# EAGLE schematic 140006R_3HP_Upgrade (EAGLE 6.5.0)

## Sheet 1 of 4
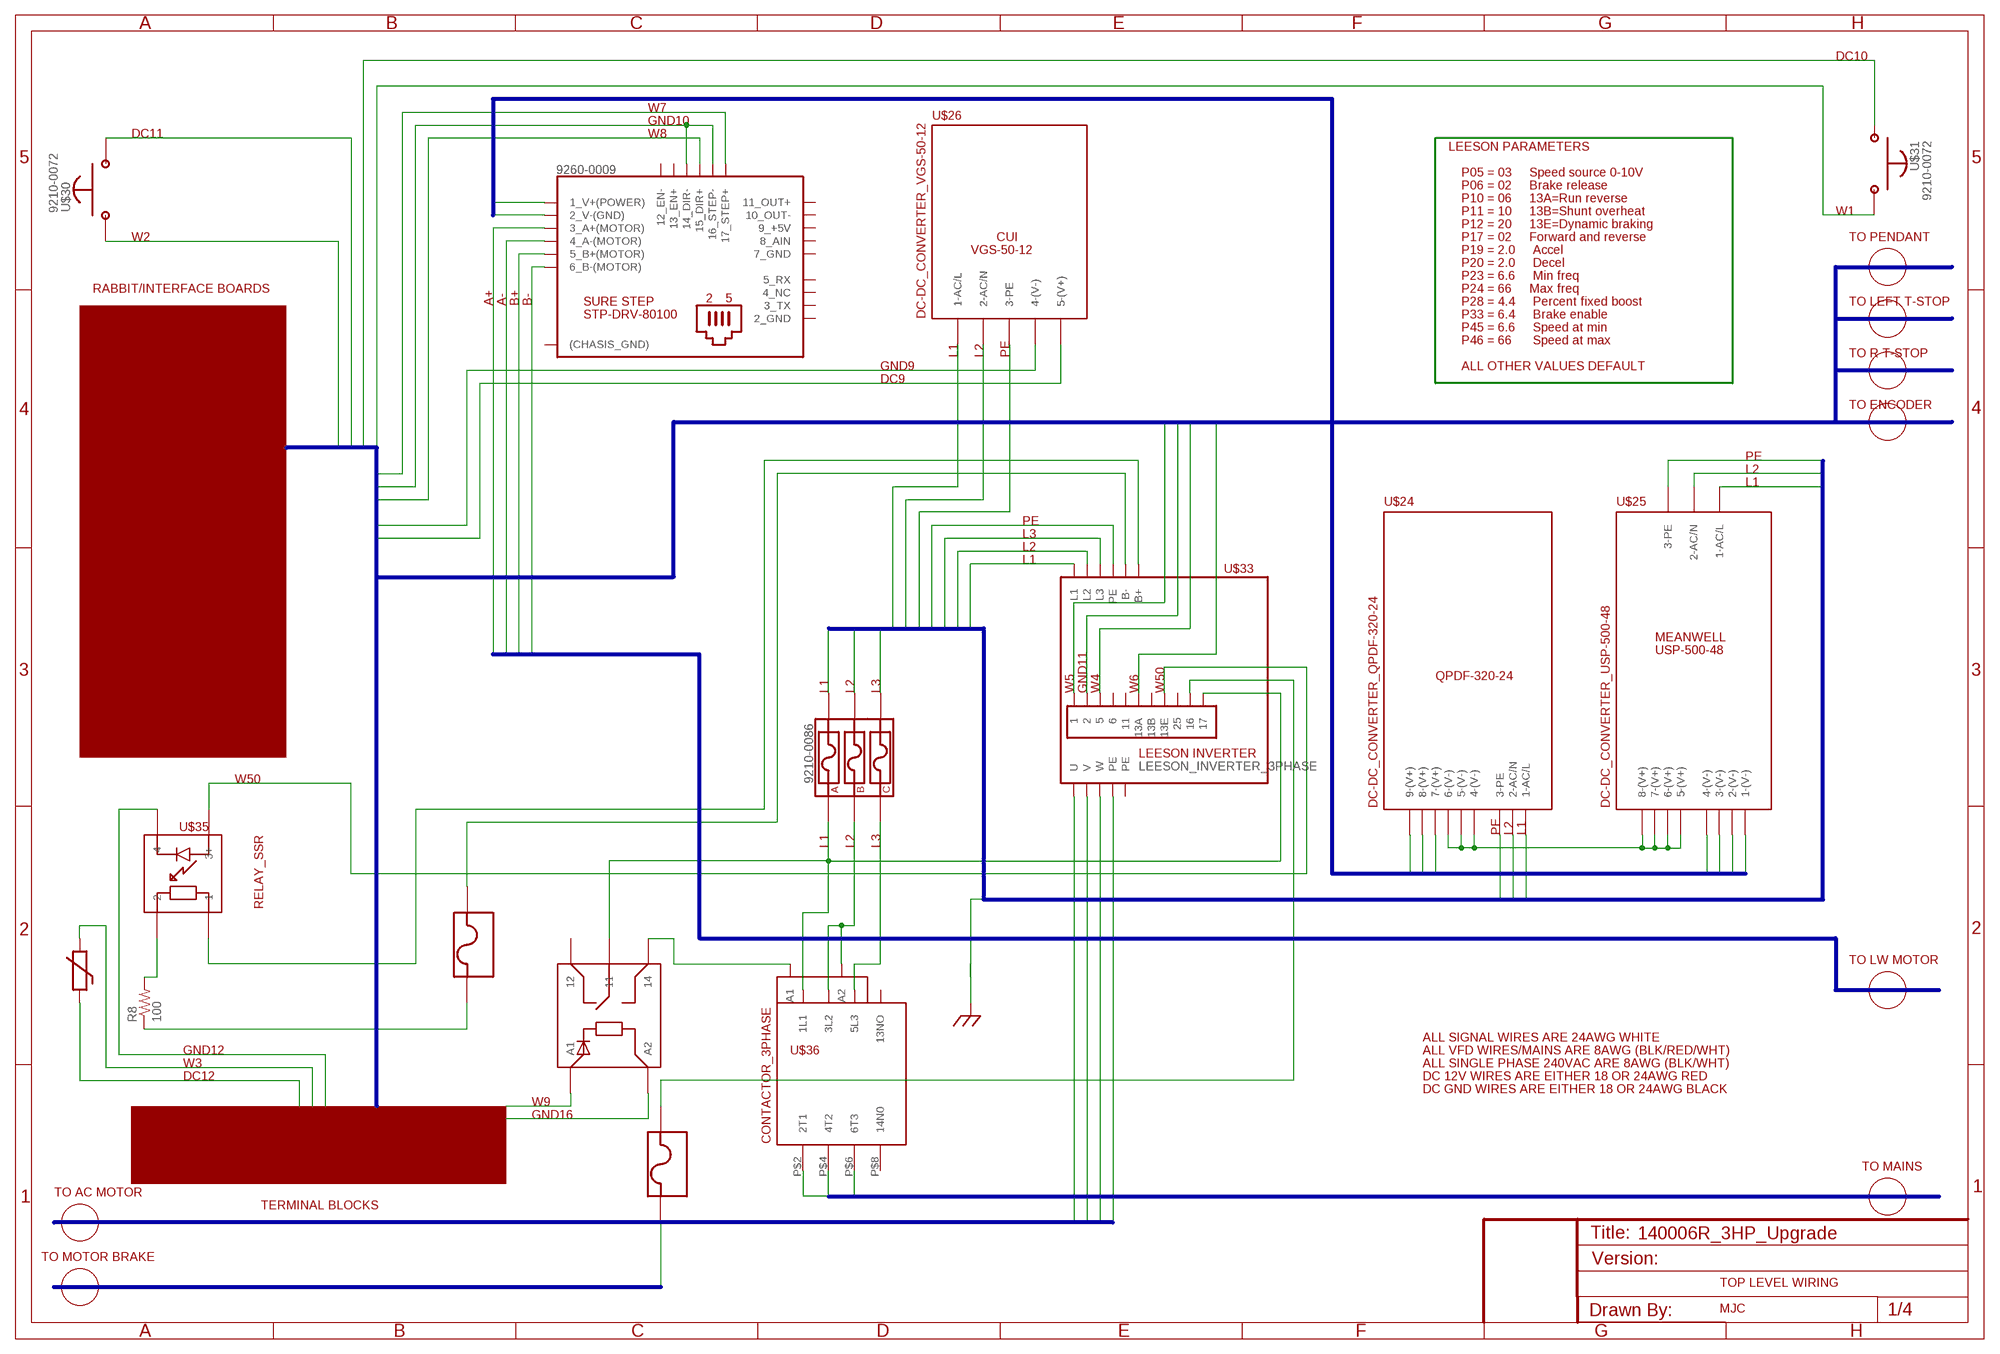
[diagram p0: schematic, sheet 1]

### Parts
PE2  GND_CHASSIS  [BOGUS]
R8  100  R-US_V234/12  [V234/12]
U$24  DC-DC_CONVERTER_QPDF-320-24  [BOGUS]
U$25  DC-DC_CONVERTER_USP-500-48  [BOGUS]
U$26  DC-DC_CONVERTER_VGS-50-12  [BOGUS]
U$27  THERMISTOR  [BOGUS]
U$28  TERMINAL_BLOCK_FUSED  [BOGUS]
U$29  TERMINAL_BLOCK_FUSED  [BOGUS]
U$30  SWITCH_MOM_NO  [BOGUS]
U$31  SWITCH_MOM_NO  [BOGUS]
U$32  SURE_STEP_STP-DRV-80100  [BOGUS]
U$33  LEESON_INVERTER_3PHASE  [BOGUS]
U$34  FUSE_HOLDER_3-POLE  [BOGUS]
U$35  RELAY_SSR  [BOGUS]
U$36  CONTACTOR_3PHASE  [BOGUS]
U$37  RELAY_TB  [BOGUS]

### Nets
B$1: PE2.P$1(PE) U$36.P$2(2T1) U$36.P$4(4T2) U$36.P$6(6T3)
B$8: U$33.P$18(PE) U$33.P$20(U) U$33.P$21(V) U$33.P$22(W)
B$9: U$24.P$1(1-AC/L) U$24.P$2(2-AC/N) U$24.P$3(3-PE) U$25.P$2(1-AC/L) U$25.P$4(2-AC/N) U$25.P$6(3-PE) U$26.P$1(1-AC/L) U$26.P$2(2-AC/N) U$26.P$3(3-PE) U$33.P$10 U$33.P$14(L1) U$33.P$15(L2) U$33.P$16(L3) U$33.P$17(PE) U$34.P$2 U$34.P$3 U$34.P$4 U$34.P$6 U$36.P$1(1L1) U$37.P$1
B$10: U$24.P$7(7-(V+)) U$24.P$8(8-(V+)) U$24.P$9(9-(V+)) U$25.P$1(1-(V-)) U$25.P$3(2-(V-)) U$25.P$5(3-(V-)) U$25.P$7(4-(V-)) U$32.P$2(1_V+(POWER)) U$32.P$3(2_V-(GND))
B$11: U$26.P$4(4-(V-)) U$26.P$5(5-(V+)) U$30.P$1 U$30.P$2 U$31.P$2 U$32.P$15(14_DIR-) U$32.P$16(15_DIR+) U$32.P$17(16_STEP-) U$32.P$18(17_STEP+) U$33.P$1 U$33.P$2 U$33.P$3 U$33.P$6(13A)
B$12: U$28.P$1
B$13: U$32.P$4(3_A+(MOTOR)) U$32.P$5(4_A-(MOTOR)) U$32.P$6(5_B+(MOTOR)) U$32.P$7(6_B-(MOTOR))
N$12: U$24.P$4(4-(V-)) U$24.P$5(5-(V-)) U$24.P$6(6-(V-)) U$25.P$8(5-(V+)) U$25.P$9(6-(V+)) U$25.P$10(7-(V+)) U$25.P$11(8-(V+))
N$13: U$29.P$2 U$33.P$13(B-)
N$14: U$33.P$12(B+) U$35.P$1
N$15: R8.2 U$35.P$2
N$16: R8.1 U$29.P$1
N$17: U$28.P$2 U$33.P$9
N$18: U$33.P$8(13E) U$35.P$3(3+)
N$19: U$35.P$4
N$20: U$27.P$1
N$21: U$27.P$2
N$25: U$34.P$5 U$36.P$5(5L3)
N$26: U$34.P$1 U$36.P$3(3L2) U$36.P$10(A2)
N$28: U$37.P$5(A2)
N$29: U$37.P$4(A1)
N$30: U$36.P$9(A1) U$37.P$3
Unconnected: U$31.P$1 U$33.P$4 U$33.P$5 U$33.P$7(13B) U$33.P$11 U$36.P$7(13NO) U$36.P$8(14N0) U$37.P$2

### Buses
B$1
B$2
B$3
B$4
B$5
B$6
B$7

### Notes on the sheet
- DC10
- W7
- GND10
- DC11 | W8
- LEESON PARAMETERS
- P05 = 03     Speed source 0-10V
- P06 = 02     Brake release
- P10 = 06     13A=Run reverse
- P11 = 10     13B=Shunt overheat | W1
- P12 = 20     13E=Dynamic braking
- W2 | P17 = 02     Forward and reverse | TO PENDANT
- P19 = 2.0     Accel
- P20 = 2.0     Decel
- P23 = 6.6     Min freq
- RABBIT/INTERFACE BOARDS | P24 = 66     Max freq
- A+ | A- | B+ | B- | P28 = 4.4     Percent fixed boost | TO LEFT T-STOP
- P33 = 6.4     Brake enable
- P45 = 6.6     Speed at min
- P46 = 66      Speed at max
- L1 | L2 | PE | TO R T-STOP
- GND9 | ALL OTHER VALUES DEFAULT
- DC9
- TO ENCODER
- PE
- L2
- L1
- PE
- L3
- L2
- L1
- L1 | L2 | L3 | W5 | GND11 | W4 | W6 | W50
- W50
- PE | L2 | L1
- L1 | L2 | L3
- TO LW MOTOR
- ALL SIGNAL WIRES ARE 24AWG WHITE
- GND12 | ALL VFD WIRES/MAINS ARE 8AWG (BLK/RED/WHT)
- W3 | ALL SINGLE PHASE 240VAC ARE 8AWG (BLK/WHT)
- DC12 | DC 12V WIRES ARE EITHER 18 OR 24AWG RED
- DC GND WIRES ARE EITHER 18 OR 24AWG BLACK
- W9
- GND16
- TO MAINS
- TO AC MOTOR
- TERMINAL BLOCKS
- TO MOTOR BRAKE
- TOP LEVEL WIRING
- MJC

## Sheet 2 of 4
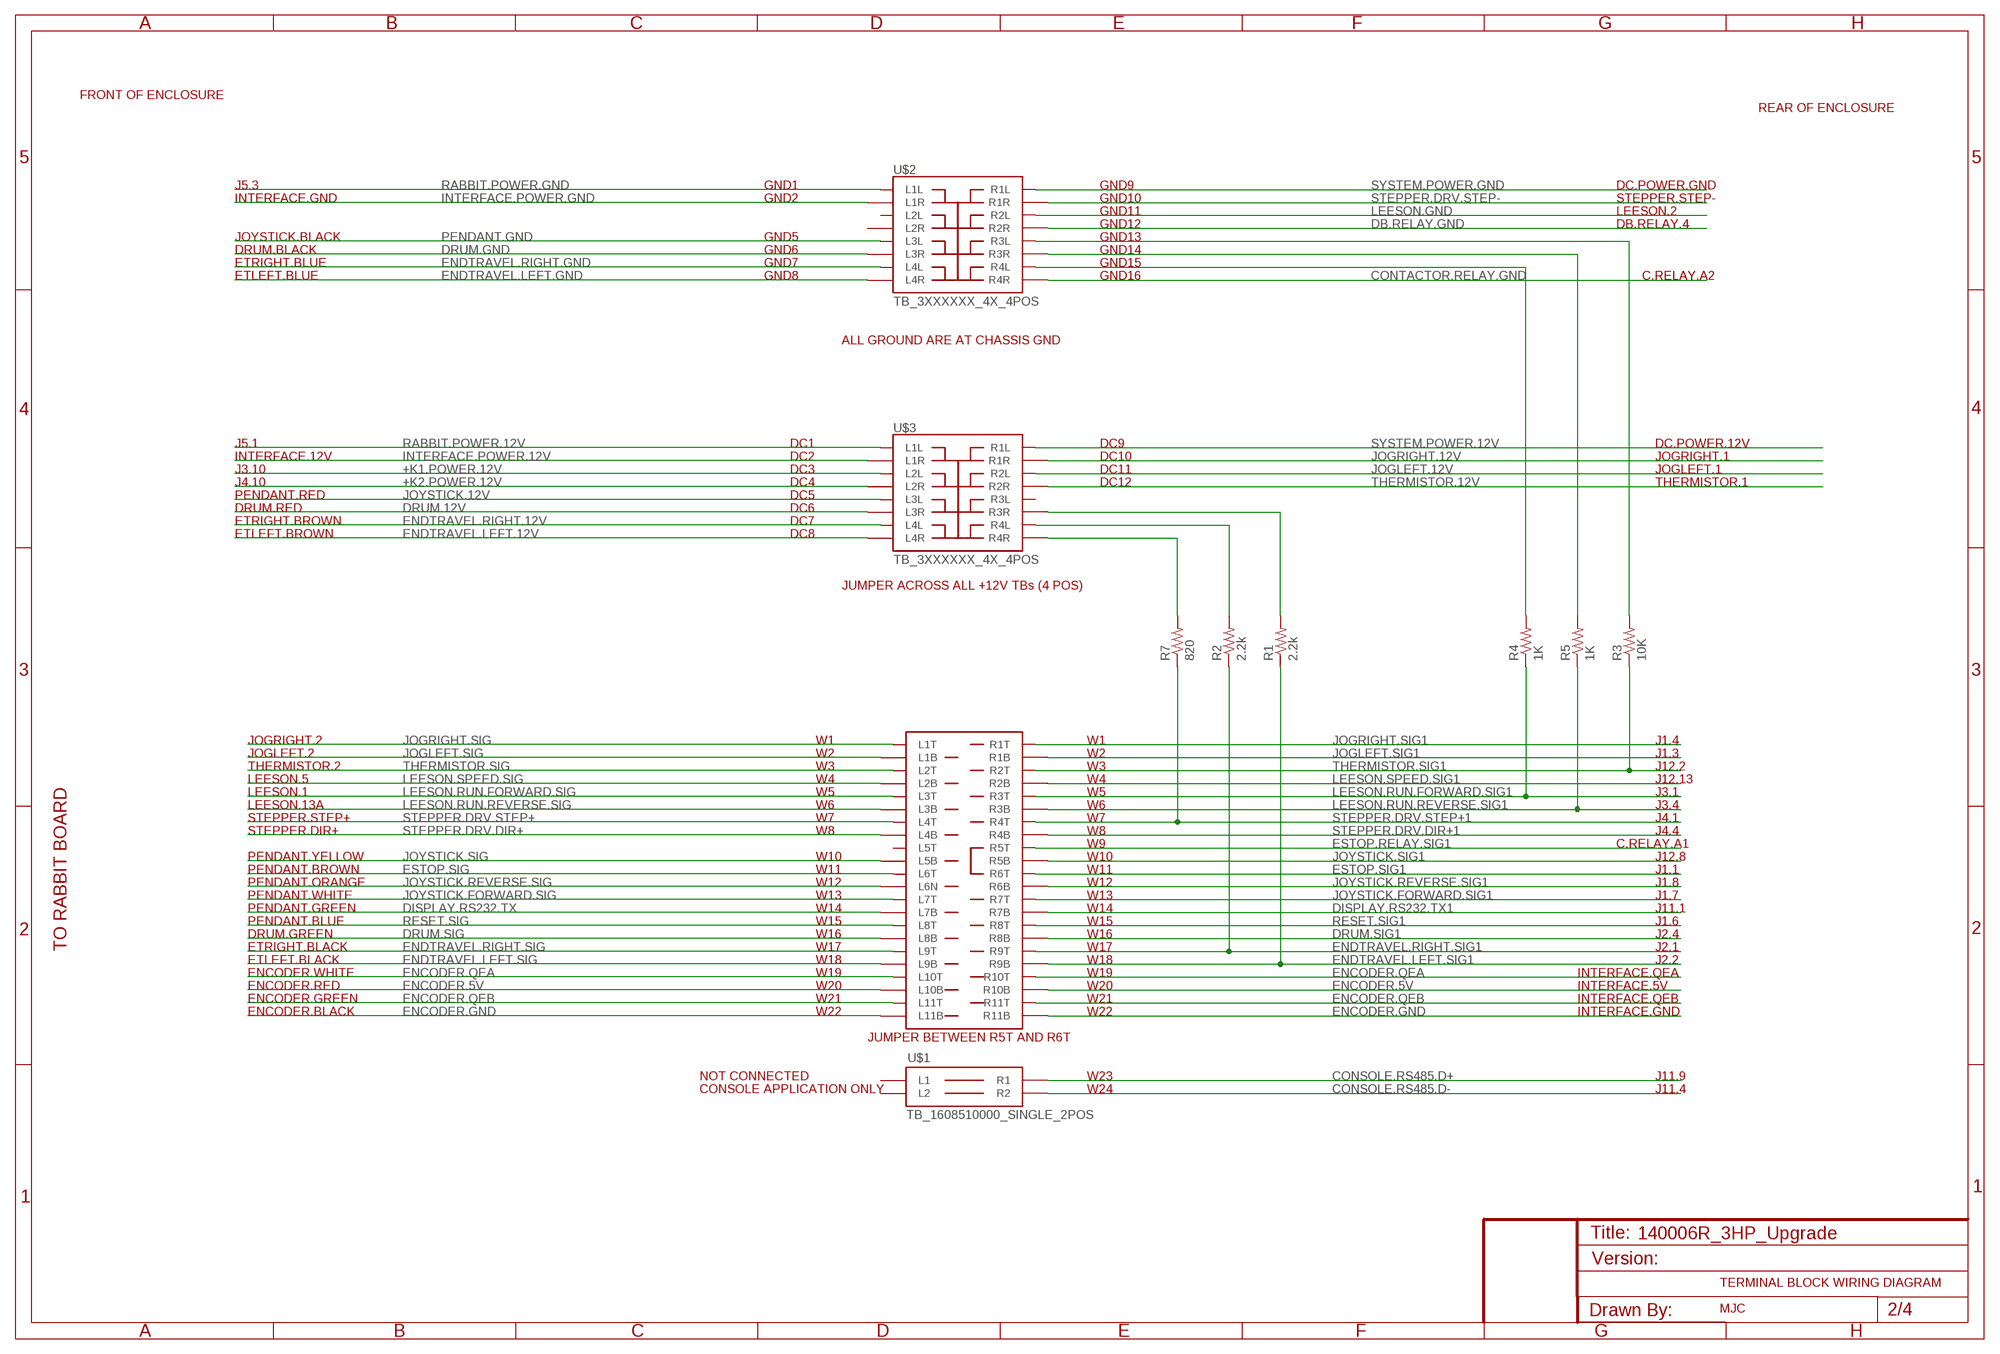
[diagram p1: schematic, sheet 2]

### Parts
R1  2.2k  R-US_V234/12  [V234/12]
R2  2.2k  R-US_V234/12  [V234/12]
R3  10K  R-US_V234/12  [V234/12]
R4  1K  R-US_V234/12  [V234/12]
R5  1K  R-US_V234/12  [V234/12]
R7  820  R-US_V234/12  [V234/12]
U$1  TB_1608510000_SINGLE_2POS  [BOGUS]
U$2  TB_3XXXXXX_4X_4POS  [BOGUS]
U$3  TB_3XXXXXX_4X_4POS  [BOGUS]
U$4  TB_3031160_11POS_DUAL_2  [BOGUS]

### Nets
+K1.POWER.12V: U$3.P$3(L2L) ; also sheet 4
+K2.POWER.12V: U$3.P$4(L2R) ; also sheet 4
CONSOLE.RS485.D+: U$1.P$3(R1) ; also sheet 4
CONSOLE.RS485.D-: U$1.P$4(R2) ; also sheet 4
CONTACTOR.RELAY.GND: U$2.P$16(R4R)
DB.RELAY.GND: U$2.P$12(R2R)
DISPLAY.RS232.TX: U$4.P$13(L7B) ; also sheet 4
DRUM.12V: U$3.P$6(L3R)
DRUM.GND: U$2.P$6(L3R)
DRUM.SIG: U$4.P$15(L8B)
ENCODER.5V: U$4.P$19(L10B) U$4.P$41(R10B) ; also sheet 4
ENCODER.GND: U$4.P$21(L11B) U$4.P$43(R11B) ; also sheet 4
ENCODER.QEA: U$4.P$20(L10T) U$4.P$42(R10T)
ENCODER.QEB: U$4.P$22(L11T) U$4.P$44(R11T)
ENDTRAVEL.LEFT.12V: U$3.P$8(L4R)
ENDTRAVEL.LEFT.GND: U$2.P$8(L4R)
ENDTRAVEL.LEFT.SIG: U$4.P$17(L9B) ; also sheet 4
ENDTRAVEL.LEFT.SIG1: R1.1
ENDTRAVEL.RIGHT.12V: U$3.P$7(L4L)
ENDTRAVEL.RIGHT.GND: U$2.P$7(L4L)
ENDTRAVEL.RIGHT.SIG: U$4.P$18(L9T) ; also sheet 4
ENDTRAVEL.RIGHT.SIG1: R2.1
ESTOP.SIG: U$4.P$12(L6T) ; also sheet 4
INTERFACE.POWER.12V: U$3.P$2(L1R) ; also sheet 4
INTERFACE.POWER.GND: U$2.P$2(L1R) ; also sheet 4
JOG.RIGHT.12V: R7.2 U$3.P$16(R4R)
JOGLEFT.SIG: U$4.P$1(L1B) ; also sheet 4
JOGRIGHT.SIG: U$4.P$2(L1T) ; also sheet 4
JOYSTICK.12V: U$3.P$5(L3L)
JOYSTICK.FORWARD.SIG: U$4.P$14(L7T) ; also sheet 4
JOYSTICK.REVERSE.SIG: U$4.P$11(L6N) ; also sheet 4
JOYSTICK.SIG: U$4.P$9(L5B) ; also sheet 4
LEESON.GND: U$2.P$11(R2L)
LEESON.RUN.FORWARD.SIG: U$4.P$6(L3T)
LEESON.RUN.FORWARD.SIG1: R4.1
LEESON.RUN.REVERSE.SIG: U$4.P$5(L3B) ; also sheet 4
LEESON.RUN.REVERSE.SIG1: R5.1
LEESON.SPEED.SIG: U$4.P$3(L2B) ; also sheet 4
N$6: R2.2 U$3.P$15(R4L)
N$7: R1.2 U$3.P$14(R3R)
N$8: R4.2 U$2.P$15(R4L)
N$9: R5.2 U$2.P$14(R3R)
N$10: R3.2 U$2.P$13(R3L)
PENDANT.GND: U$2.P$5(L3L)
RABBIT.POWER.12V: U$3.P$1(L1L) ; also sheet 4
RABBIT.POWER.GND: U$2.P$1(L1L) ; also sheet 4
RESET.SIG: U$4.P$16(L8T) ; also sheet 4
STEPPER.DRV.DIR+: U$4.P$7(L4B) ; also sheet 4
STEPPER.DRV.STEP+: U$4.P$8(L4T) ; also sheet 4
STEPPER.DRV.STEP+1: R7.1
STEPPER.DRV.STEP-: U$2.P$10(R1R)
SYSTEM.POWER.GND: U$2.P$9(R1L)
THERMISTOR.12V: U$3.P$12(R2R)
THERMISTOR.SIG: U$4.P$4(L2T) ; also sheet 4
THERMISTOR.SIG1: R3.1
Unconnected: U$1.P$1(L1) U$1.P$2(L2) U$2.P$3(L2L) U$2.P$4(L2R) U$3.P$9(R1L) U$3.P$10(R1R) U$3.P$11(R2L) U$3.P$13(R3L) U$4.P$10(L5T) U$4.P$23(R1B) U$4.P$24(R1T) U$4.P$25(R2B) U$4.P$26(R2T) U$4.P$27(R3B) U$4.P$28(R3T) U$4.P$29(R4B) U$4.P$30(R4T) U$4.P$31(R5B) U$4.P$32(R5T) U$4.P$33(R6B) U$4.P$34(R6T) U$4.P$35(R7B) U$4.P$36(R7T) U$4.P$37(R8B) U$4.P$38(R8T) U$4.P$39(R9B) U$4.P$40(R9T)

### Notes on the sheet
- FRONT OF ENCLOSURE
- REAR OF ENCLOSURE
- J5.3 | GND1 | GND9 | DC.POWER.GND
- INTERFACE.GND | GND2 | GND10 | STEPPER.STEP-
- GND11 | LEESON.2
- GND12 | DB.RELAY.4
- JOYSTICK.BLACK | GND5 | GND13
- DRUM.BLACK | GND6 | GND14
- ETRIGHT.BLUE | GND7 | GND15
- ETLEFT.BLUE | GND8 | GND16 | C.RELAY.A2
- ALL GROUND ARE AT CHASSIS GND
- J5.1 | DC1 | DC9 | DC.POWER.12V
- INTERFACE.12V | DC2 | DC10 | JOGRIGHT.1
- J3.10 | DC3 | DC11 | JOGLEFT.1
- J4.10 | DC4 | DC12 | THERMISTOR.1
- PENDANT.RED | DC5
- DRUM.RED | DC6
- ETRIGHT.BROWN | DC7
- ETLEFT.BROWN | DC8
- JUMPER ACROSS ALL +12V TBs (4 POS)
- JOGRIGHT.2 | W1 | W1 | J1.4
- JOGLEFT.2 | W2 | W2 | J1.3
- THERMISTOR.2 | W3 | W3 | J12.2
- LEESON.5 | W4 | W4 | J12.13
- LEESON.1 | W5 | W5 | J3.1
- LEESON.13A | W6 | W6 | J3.4
- STEPPER.STEP+ | W7 | W7 | J4.1
- STEPPER.DIR+ | W8 | W8 | J4.4
- W9 | C.RELAY.A1
- PENDANT.YELLOW | W10 | W10 | J12.8
- PENDANT.BROWN | W11 | W11 | J1.1
- PENDANT.ORANGE | W12 | W12 | J1.8
- PENDANT.WHITE | W13 | W13 | J1.7
- PENDANT.GREEN | W14 | W14 | J11.1
- PENDANT.BLUE | W15 | W15 | J1.6
- DRUM.GREEN | W16 | W16 | J2.4
- TO RABBIT BOARD | ETRIGHT.BLACK | W17 | W17 | J2.1
- ETLEFT.BLACK | W18 | W18 | J2.2
- ENCODER.WHITE | W19 | W19 | INTERFACE.QEA
- ENCODER.RED | W20 | W20 | INTERFACE.5V
- ENCODER.GREEN | W21 | W21 | INTERFACE.QEB
- ENCODER.BLACK | W22 | W22 | INTERFACE.GND
- JUMPER BETWEEN R5T AND R6T
- NOT CONNECTED | W23 | J11.9
- CONSOLE APPLICATION ONLY | W24 | J11.4
- TERMINAL BLOCK WIRING DIAGRAM
- MJC

## Sheet 3 of 4
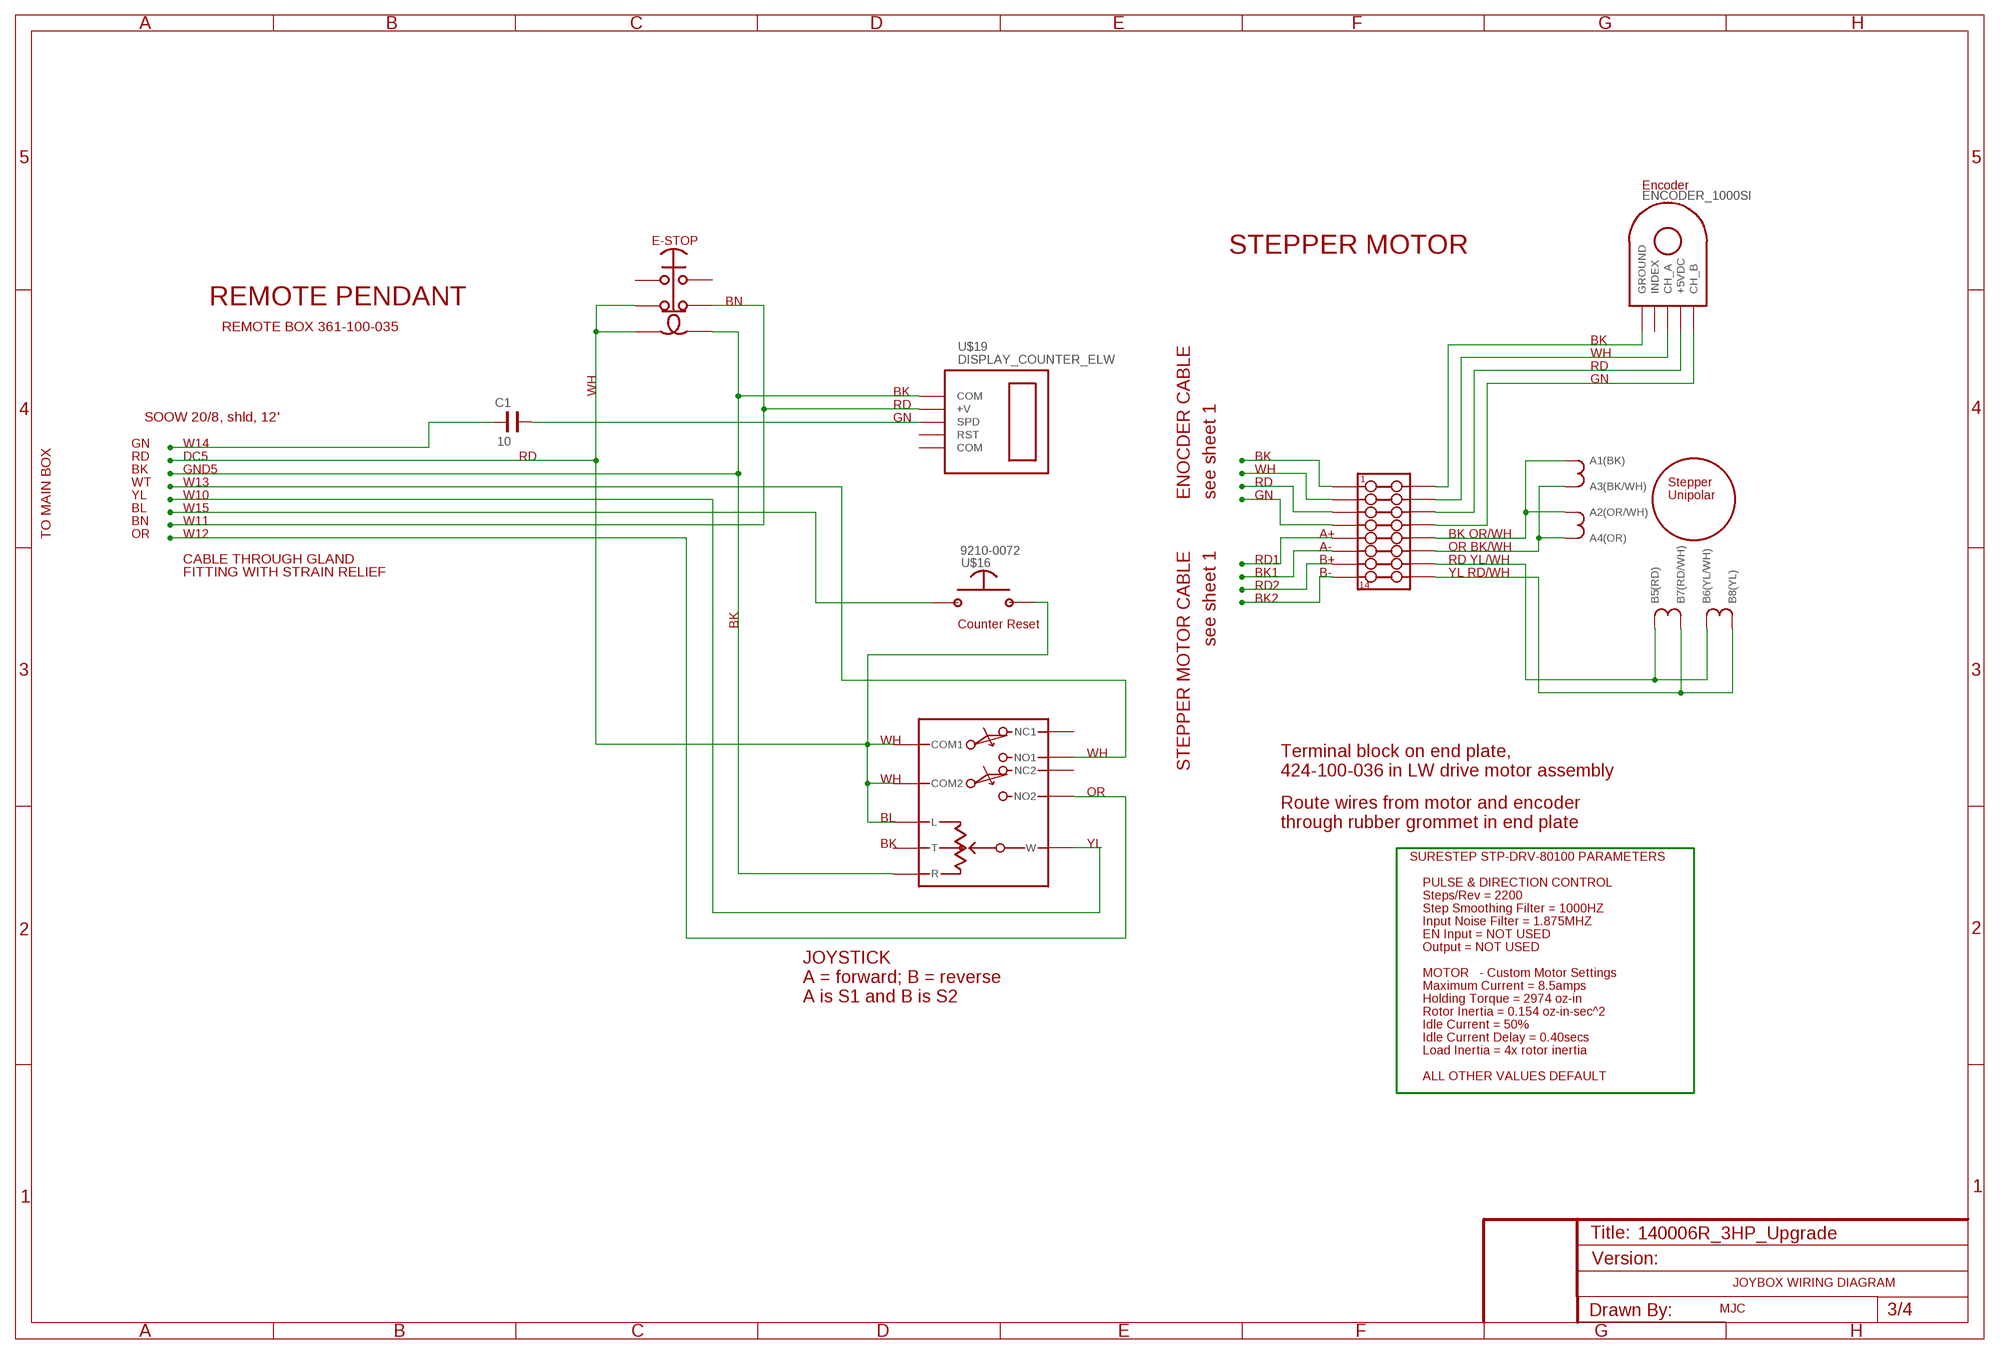
[diagram p2: schematic, sheet 3]

### Parts
C1  10  C0805  [R0805]
U$16  Counter Reset  SWITCH_MOM_NO  [BOGUS]
U$17  SWITCH_ESTOP_LIGHTED  [BOGUS]
U$18  JOYSTICK_PRO-5  [BOGUS]
U$19  DISPLAY_COUNTER_ELW  [BOGUS]
U$20  TERMINAL_BLOCK_8  [BOGUS]
U$21  MOTOR_STEPPER_UNIPOLAR  [BOGUS]
U$22  ENCODER_1000SI  [BOGUS]

### Nets
N$4: U$17.P$6 U$18.P$8(R) U$19.P$2(COM)
N$23: C1.2 U$19.P$5(SPD)
N$69: C1.1
N$72: U$18.P$6(NO1)
N$73: U$18.P$10(W)
N$75: U$17.P$4 U$19.P$1(+V)
N$76: U$18.P$7(NO2)
N$77: U$16.P$1
N$78: U$16.P$2 U$17.P$2 U$17.P$5 U$18.P$1(COM1) U$18.P$2(COM2) U$18.P$3(L)
N$81: U$20.P$12 U$21.P$1(A1(BK)) U$21.P$2(A2(OR/WH))
N$88: U$20.P$11 U$21.P$3(A3(BK/WH)) U$21.P$4(A4(OR))
N$89: U$20.P$9 U$21.P$7(B7(RD/WH)) U$21.P$8(B8(YL))
N$91: U$20.P$10 U$21.P$5(B5(RD)) U$21.P$6(B6(YL/WH))
N$92: U$20.P$16 U$22.P$4(GROUND)
N$93: U$20.P$15 U$22.P$2(CH_A)
N$94: U$20.P$14 U$22.P$1(+5VDC)
N$95: U$20.P$13 U$22.P$3(CH_B)
N$96: U$20.P$1
N$97: U$20.P$2
N$98: U$20.P$3
N$99: U$20.P$4
N$100: U$20.P$8
N$101: U$20.P$7
N$102: U$20.P$6
N$103: U$20.P$5
Unconnected: U$17.P$1 U$17.P$3 U$18.P$4(NC1) U$18.P$5(NC2) U$18.P$9(T) U$19.P$3(COM) U$19.P$4(RST) U$22.P$5(INDEX)

### Notes on the sheet
- STEPPER MOTOR
- REMOTE PENDANT | BN
- REMOTE BOX 361-100-035
- BK
- WH
- RD
- GN
- WH | BK
- RD
- SOOW 20/8, shld, 12' | GN
- TO MAIN BOX | GN | W14
- RD | DC5 | RD | BK
- BK | GND5 | WH
- WT | W13 | RD
- YL | W10 | ENOCDER CABLE | see sheet 1 | GN
- BL | W15
- BN | W11
- OR | W12 | A+ | BK OR/WH
- STEPPER MOTOR CABLE | see sheet 1 | A- | OR BK/WH
- CABLE THROUGH GLAND | RD1 | B+ | RD YL/WH
- FITTING WITH STRAIN RELIEF | BK1 | B- | YL RD/WH
- RD2
- BK2
- BK | Counter Reset
- WH
- WH | Terminal block on end plate,
- 424-100-036 in LW drive motor assembly
- WH
- OR
- Route wires from motor and encoder
- BL
- through rubber grommet in end plate
- BK | YL
- SURESTEP STP-DRV-80100 PARAMETERS
- PULSE & DIRECTION CONTROL
- Steps/Rev = 2200
- Step Smoothing Filter = 1000HZ
- Input Noise Filter = 1.875MHZ
- EN Input = NOT USED
- Output = NOT USED
- JOYSTICK
- MOTOR   - Custom Motor Settings
- A = forward; B = reverse
- Maximum Current = 8.5amps
- A is S1 and B is S2 | Holding Torque = 2974 oz-in
- Rotor Inertia = 0.154 oz-in-sec^2
- Idle Current = 50%
- Idle Current Delay = 0.40secs
- Load Inertia = 4x rotor inertia
- ALL OTHER VALUES DEFAULT
- JOYBOX WIRING DIAGRAM
- MJC

## Sheet 4 of 4
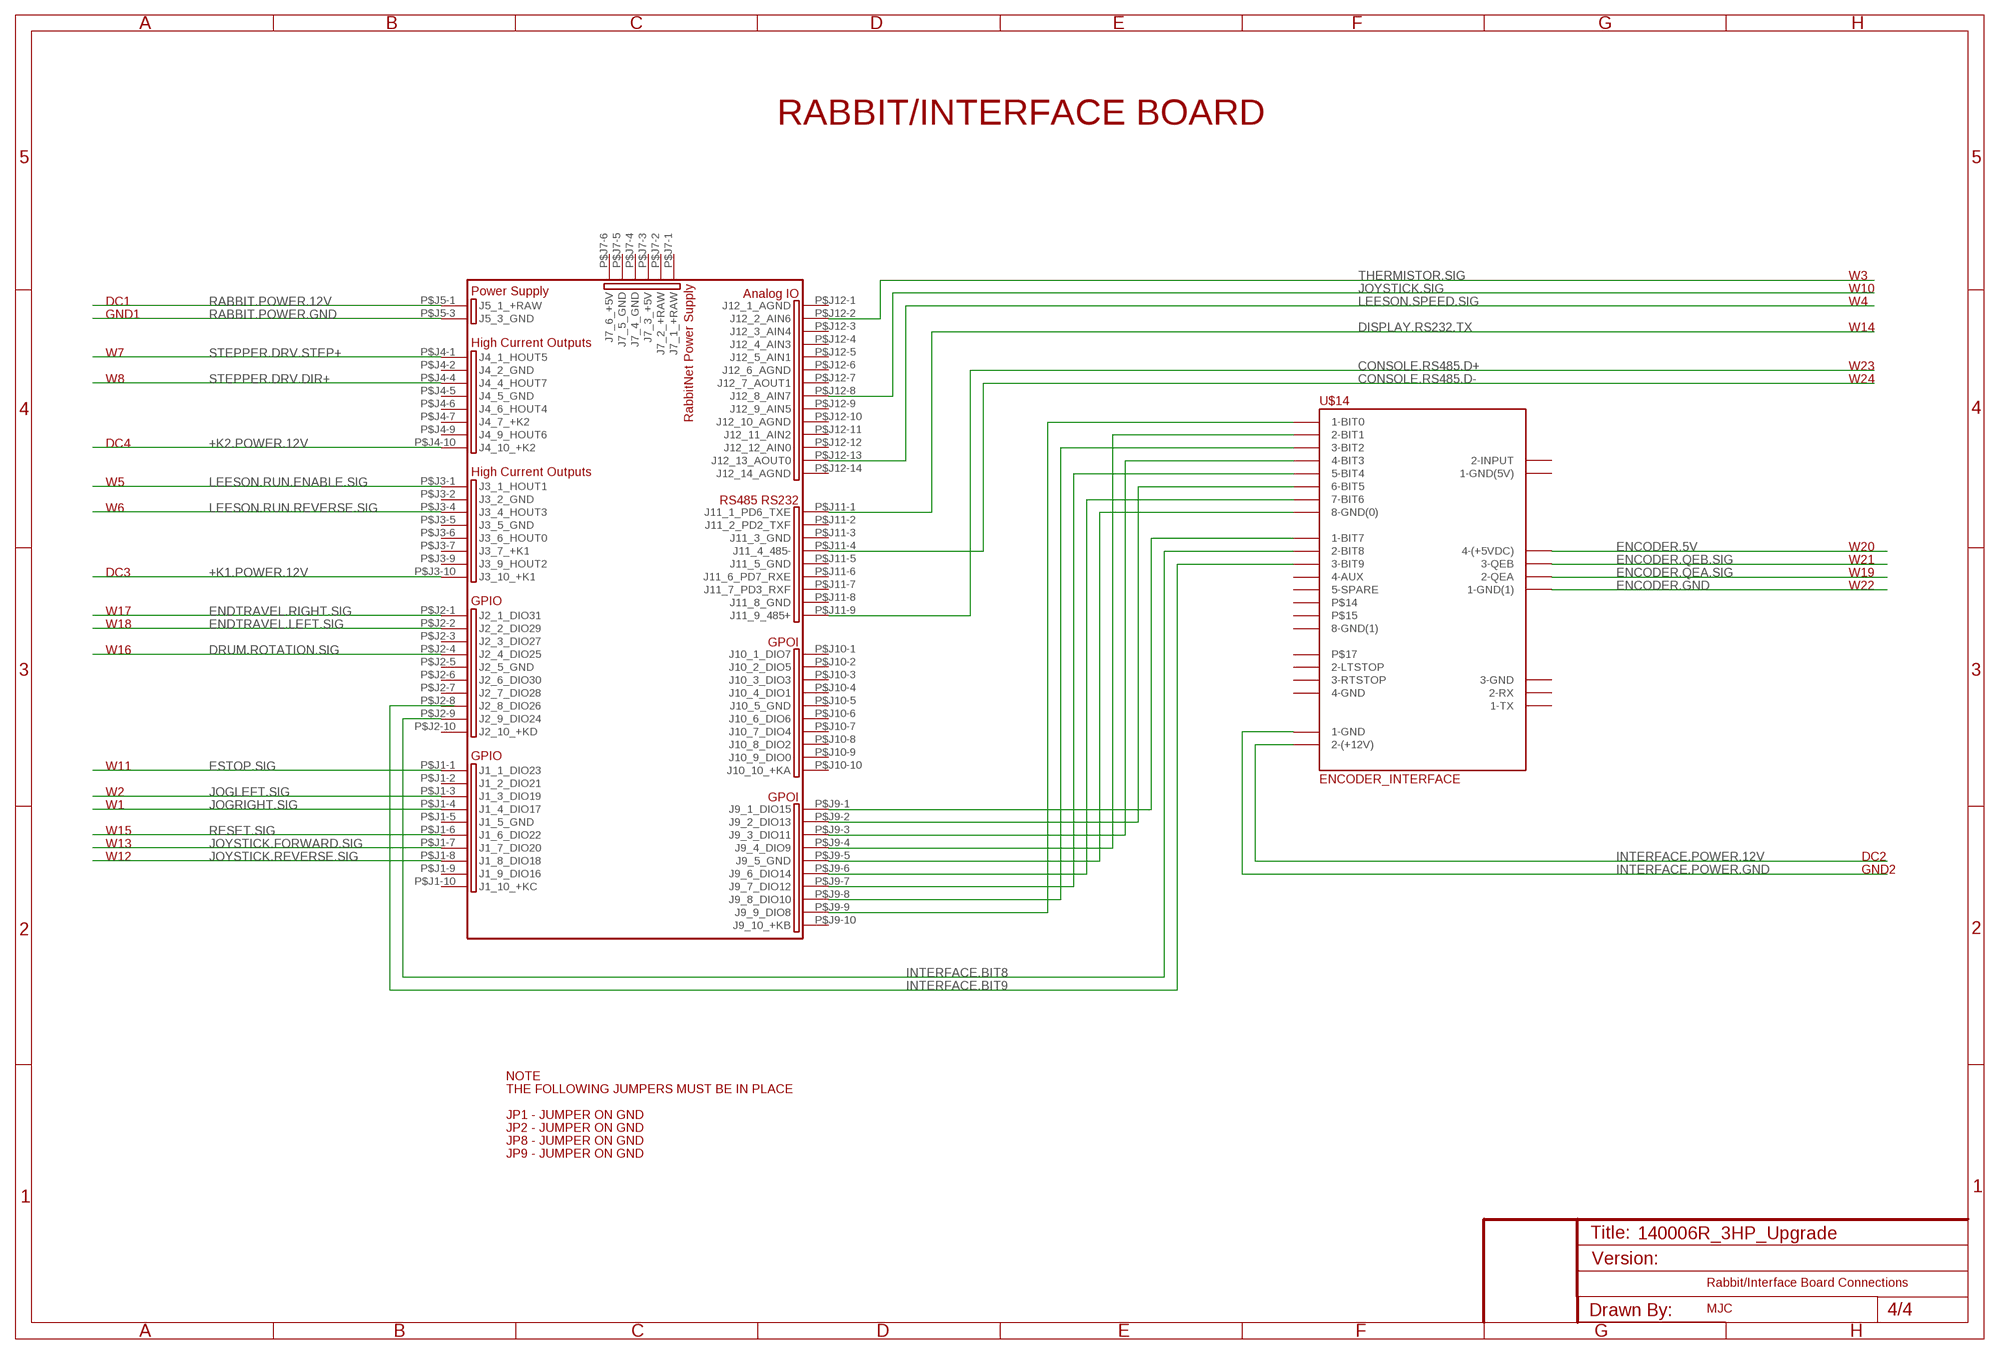
[diagram p3: schematic, sheet 4]

### Parts
U$14  ENCODER_INTERFACE  [BOGUS]
U$15  RABBIT_BL4S200(RCM4310)  [RABBIT_BL4S200]

### Nets
+K1.POWER.12V: U$15.P$J3-10(J3_10_+K1) ; also sheet 2
+K2.POWER.12V: U$15.P$J4-10(J4_10_+K2) ; also sheet 2
CONSOLE.RS485.D+: U$15.P$J11-9(J11_9_485+) ; also sheet 2
CONSOLE.RS485.D-: U$15.P$J11-4(J11_4_485-) ; also sheet 2
DISPLAY.RS232.TX: U$15.P$J11-1(J11_1_PD6_TXE) ; also sheet 2
DRUM.ROTATION.SIG: U$15.P$J2-4(J2_4_DIO25)
ENCODER.5V: U$14.P$19(4-(+5VDC)) ; also sheet 2
ENCODER.GND: U$14.P$4(1-GND(1)) ; also sheet 2
ENCODER.QEA.SIG: U$14.P$12(2-QEA)
ENCODER.QEB.SIG: U$14.P$17(3-QEB)
ENDTRAVEL.LEFT.SIG: U$15.P$J2-2(J2_2_DIO29) ; also sheet 2
ENDTRAVEL.RIGHT.SIG: U$15.P$J2-1(J2_1_DIO31) ; also sheet 2
ESTOP.SIG: U$15.P$J1-1(J1_1_DIO23) ; also sheet 2
INTERFACE.BIT7: U$14.P$2(1-BIT7) U$15.P$J9-1(J9_1_DIO15)
INTERFACE.BIT8: U$14.P$9(2-BIT8) U$15.P$J2-9(J2_9_DIO24)
INTERFACE.BIT9: U$14.P$15(3-BIT9)
INTERFACE.GND: U$14.P$27(8-GND(0)) U$15.P$J9-5(J9_5_GND)
INTERFACE.POWER.12V: U$14.P$7(2-(+12V)) ; also sheet 2
INTERFACE.POWER.GND: U$14.P$3(1-GND) ; also sheet 2
JOGLEFT.SIG: U$15.P$J1-3(J1_3_DIO19) ; also sheet 2
JOGRIGHT.SIG: U$15.P$J1-4(J1_4_DIO17) ; also sheet 2
JOYSTICK.FORWARD.SIG: U$15.P$J1-7(J1_7_DIO20) ; also sheet 2
JOYSTICK.REVERSE.SIG: U$15.P$J1-8(J1_8_DIO18) ; also sheet 2
JOYSTICK.SIG: U$15.P$J12-8(J12_8_AIN7) ; also sheet 2
LEESON.RUN.ENABLE.SIG: U$15.P$J3-1(J3_1_HOUT1)
LEESON.RUN.REVERSE.SIG: U$15.P$J3-4(J3_4_HOUT3) ; also sheet 2
LEESON.SPEED.SIG: U$15.P$J12-13(J12_13_AOUT0) ; also sheet 2
N$1: U$14.P$21(4-BIT3) U$15.P$J9-3(J9_3_DIO11)
N$71: U$14.P$25(6-BIT5) U$15.P$J9-2(J9_2_DIO13)
N$79: U$14.P$8(2-BIT1) U$15.P$J9-4(J9_4_DIO9)
N$80: U$14.P$26(7-BIT6) U$15.P$J9-6(J9_6_DIO14)
N$85: U$14.P$23(5-BIT4) U$15.P$J9-7(J9_7_DIO12)
N$86: U$14.P$14(3-BIT2) U$15.P$J9-8(J9_8_DIO10)
N$90: U$14.P$1(1-BIT0) U$15.P$J9-9(J9_9_DIO8)
RABBIT.POWER.12V: U$15.P$J5-1(J5_1_+RAW) ; also sheet 2
RABBIT.POWER.GND: U$15.P$J5-3(J5_3_GND) ; also sheet 2
RESET.SIG: U$15.P$J1-6(J1_6_DIO22) ; also sheet 2
STEPPER.DRV.DIR+: U$15.P$J4-4(J4_4_HOUT7) ; also sheet 2
STEPPER.DRV.STEP+: U$15.P$J4-1(J4_1_HOUT5) ; also sheet 2
THERMISTOR.SIG: U$15.P$J12-2(J12_2_AIN6) ; also sheet 2
Unconnected: U$14.P$5(1-GND(5V)) U$14.P$6(1-TX) U$14.P$10(2-INPUT) U$14.P$11(2-LTSTOP) U$14.P$13(2-RX) U$14.P$16(3-GND) U$14.P$18(3-RTSTOP) U$14.P$20(4-AUX) U$14.P$22(4-GND) U$14.P$24(5-SPARE) U$14.P$29 U$14.P$30 U$14.P$31 U$15.P$J1-2(J1_2_DIO21) U$15.P$J1-5(J1_5_GND) U$15.P$J1-9(J1_9_DIO16) U$15.P$J1-10(J1_10_+KC) U$15.P$J2-3(J2_3_DIO27) U$15.P$J2-5(J2_5_GND) U$15.P$J2-6(J2_6_DIO30) U$15.P$J2-7(J2_7_DIO28) U$15.P$J2-8(J2_8_DIO26) U$15.P$J2-10(J2_10_+KD) U$15.P$J3-2(J3_2_GND) U$15.P$J3-5(J3_5_GND) U$15.P$J3-6(J3_6_HOUT0) U$15.P$J3-7(J3_7_+K1) U$15.P$J3-9(J3_9_HOUT2) U$15.P$J4-2(J4_2_GND) U$15.P$J4-5(J4_5_GND) U$15.P$J4-6(J4_6_HOUT4) U$15.P$J4-7(J4_7_+K2) U$15.P$J4-9(J4_9_HOUT6) U$15.P$J7-1(J7_1_+RAW) U$15.P$J7-2(J7_2_+RAW) U$15.P$J7-3(J7_3_+5V) U$15.P$J7-4(J7_4_GND) U$15.P$J7-5(J7_5_GND) U$15.P$J7-6(J7_6_+5V) U$15.P$J9-10(J9_10_+KB) U$15.P$J10-1(J10_1_DIO7) U$15.P$J10-2(J10_2_DIO5) U$15.P$J10-3(J10_3_DIO3) U$15.P$J10-4(J10_4_DIO1) U$15.P$J10-5(J10_5_GND) U$15.P$J10-6(J10_6_DIO6) U$15.P$J10-7(J10_7_DIO4) U$15.P$J10-8(J10_8_DIO2) U$15.P$J10-9(J10_9_DIO0) U$15.P$J10-10(J10_10_+KA) U$15.P$J11-2(J11_2_PD2_TXF) U$15.P$J11-3(J11_3_GND) U$15.P$J11-5(J11_5_GND) U$15.P$J11-6(J11_6_PD7_RXE) U$15.P$J11-7(J11_7_PD3_RXF) U$15.P$J11-8(J11_8_GND) U$15.P$J12-1(J12_1_AGND) U$15.P$J12-3(J12_3_AIN4) U$15.P$J12-4(J12_4_AIN3) U$15.P$J12-5(J12_5_AIN1) U$15.P$J12-6(J12_6_AGND) U$15.P$J12-7(J12_7_AOUT1) U$15.P$J12-9(J12_9_AIN5) U$15.P$J12-10(J12_10_AGND) U$15.P$J12-11(J12_11_AIN2) U$15.P$J12-12(J12_12_AIN0) U$15.P$J12-14(J12_14_AGND)

### Notes on the sheet
- RABBIT/INTERFACE BOARD
- W3
- W10
- DC1 | W4
- GND1
- W14
- W7
- W23
- W8 | W24
- DC4
- W5
- W6
- W20
- W21
- DC3 | W19
- W22
- W17
- W18
- W16
- W11
- W2
- W1
- W15
- W13
- W12 | DC2
- GND2
- NOTE
- THE FOLLOWING JUMPERS MUST BE IN PLACE
- JP1 - JUMPER ON GND
- JP2 - JUMPER ON GND
- JP8 - JUMPER ON GND
- JP9 - JUMPER ON GND
- Rabbit/Interface Board Connections
- MJC

## Power pins joined to a net without a drawn wire
2_GND: U$32.P$19(2_GND)
3_TX: U$32.P$20(3_TX)
4_NC: U$32.P$21(4_NC)
5_RX: U$32.P$22(5_RX)
7_GND: U$32.P$8(7_GND)
8-GND(1): U$14.P$28(8-GND(1))
8_AIN: U$32.P$9(8_AIN)
9_+5V: U$32.P$10(9_+5V)
10_OUT-: U$32.P$11(10_OUT-)
11_OUT+: U$32.P$12(11_OUT+)
12_EN-: U$32.P$13(12_EN-)
13_EN+: U$32.P$14(13_EN+)
(CHASIS_GND): U$32.P$1((CHASIS_GND))
PE: U$33.P$19(PE)

## Library data of the parts
C1 = SOSI:C0805; DPN: 10009
PE2 = DougM-SOSI-Wiring-Diagram.rpt:GND_CHASSIS: SUPPLY SYMBOL
R1-R5 R7 = rcl:R-US_: RESISTOR, American symbol
R8 = resistor:R-US_: RESISTOR, American symbol
U$1 = SOSI-TerminalBlocks:TB_1608510000_SINGLE_2POS: 9210-0348
U$2 U$3 = SOSI-TerminalBlocks:TB_3XXXXXX_4X_4POS
U$4 = SOSI-TerminalBlocks:TB_3031160_11POS_DUAL_2
U$14 = DougM-SOSI-Wiring-Diagram.rpt:ENCODER_INTERFACE
U$15 = DougM.SOSI.Microcontroller:RABBIT_BL4S200(RCM4310): 9210-0442 COMPUTER SINGLE-BOARD BL4S200 Rabbit Semiconductor 20-101-1220 Digi-Key 316-1164-ND
U$16 = DougM-SOSI-Wiring-Diagram:SWITCH_MOM_NO: 9210-0072 Mouser Part #: 850-59-313 Manufacturer Part #: 59-313
U$17 = DougM-SOSI-Wiring-Diagram:SWITCH_ESTOP_LIGHTED: 9210-0045 Switch, Emergency Stop, w/ #800T-XA4 contact block (old #800H-FRXTQH10RA4) Allen Bradley 800H-FRXTQH2RA4
U$18 = DougM-SOSI-Wiring-Diagram:JOYSTICK_PRO-5: 9280-0000 PRO5-202.1085 (w/20k center tap potentiometer) Joystick (Master Switch), w/20k center tap potentiometer J. R. Merritt Controls
U$19 = DougM-SOSI-Wiring-Diagram:DISPLAY_COUNTER_ELW: 9215-0003 12062A-1 Display Board Assy., ECO-ELW line speed/counter Soundnine Inc.
U$20 = DougM-SOSI-Wiring-Diagram:TERMINAL_BLOCK_8: 9210-0073 ESO800/08DSFB CONN TERMINAL STRIP 8MM 8CIRC On Shore Technology Inc Digi-Key ED2999-ND
U$21 = DougM-SOSI-Wiring-Diagram:MOTOR_STEPPER_UNIPOLAR: 9500-0016 34Y214D-LW8-1000SI Stepper Motor with 1000 line encoder Anaheim Automation Kaman Industrial Technologies
U$22 = DougM-SOSI-Wiring-Diagram:ENCODER_1000SI: (no PN) 1000SI Single-Ended Encoder with Index Channel (comes as part of Stepper Motor assembly 9500-0016) Anaheim Automation
U$24 = DougM-SOSI-Wiring-Diagram.rpt:DC-DC_CONVERTER_QPDF-320-24
U$25 = DougM-SOSI-Wiring-Diagram.rpt:DC-DC_CONVERTER_USP-500-48
U$26 = DougM-SOSI-Wiring-Diagram.rpt:DC-DC_CONVERTER_VGS-50-12
U$27 = DougM-SOSI-Wiring-Diagram.rpt:THERMISTOR: (no PN available) (no description available) Soundnine Inc. (no vendor PN available)
U$28 U$29 = DougM-SOSI-Wiring-Diagram.rpt:TERMINAL_BLOCK_FUSED: 9210-0372 7641K943 Modular DIN Rail-Mount Terminal Block DIN 1 & 3, w/ Blown Fuse Indicator, 8mm, 24 VDC McMasterr McMaster 7641K943
U$30 U$31 = DougM-SOSI-Wiring-Diagram.rpt:SWITCH_MOM_NO: 9210-0072 Mouser Part #: 850-59-313 Manufacturer Part #: 59-313
U$32 = DougM-SOSI-Wiring-Diagram.rpt:SURE_STEP_STP-DRV-80100: 9260-0009 STP-DRV-80100 Step Motor Driver, 80 V 10A Sure Step Automation Direct
U$33 = DougM-SOSI-Wiring-Diagram.rpt:LEESON_INVERTER_3PHASE
U$34 = DougM-SOSI-Wiring-Diagram.rpt:FUSE_HOLDER_3-POLE: 9210-0086 BC6033PQ Fuseholder, Class CC & Class G, 3 pole, 600V, 30A, for 13/32x1 1/2 fuses Cooper/Bussman North Coast Electric
U$35 = DougM-SOSI-Wiring-Diagram.rpt:RELAY_SSR
U$36 = DougM-SOSI-Wiring-Diagram.rpt:CONTACTOR_3PHASE
U$37 = DougM-SOSI-Wiring-Diagram.rpt:RELAY_TB